# Altium schematic sheet Power.SchDoc
size A4; SheetNumber: 4; SheetTotal: 4
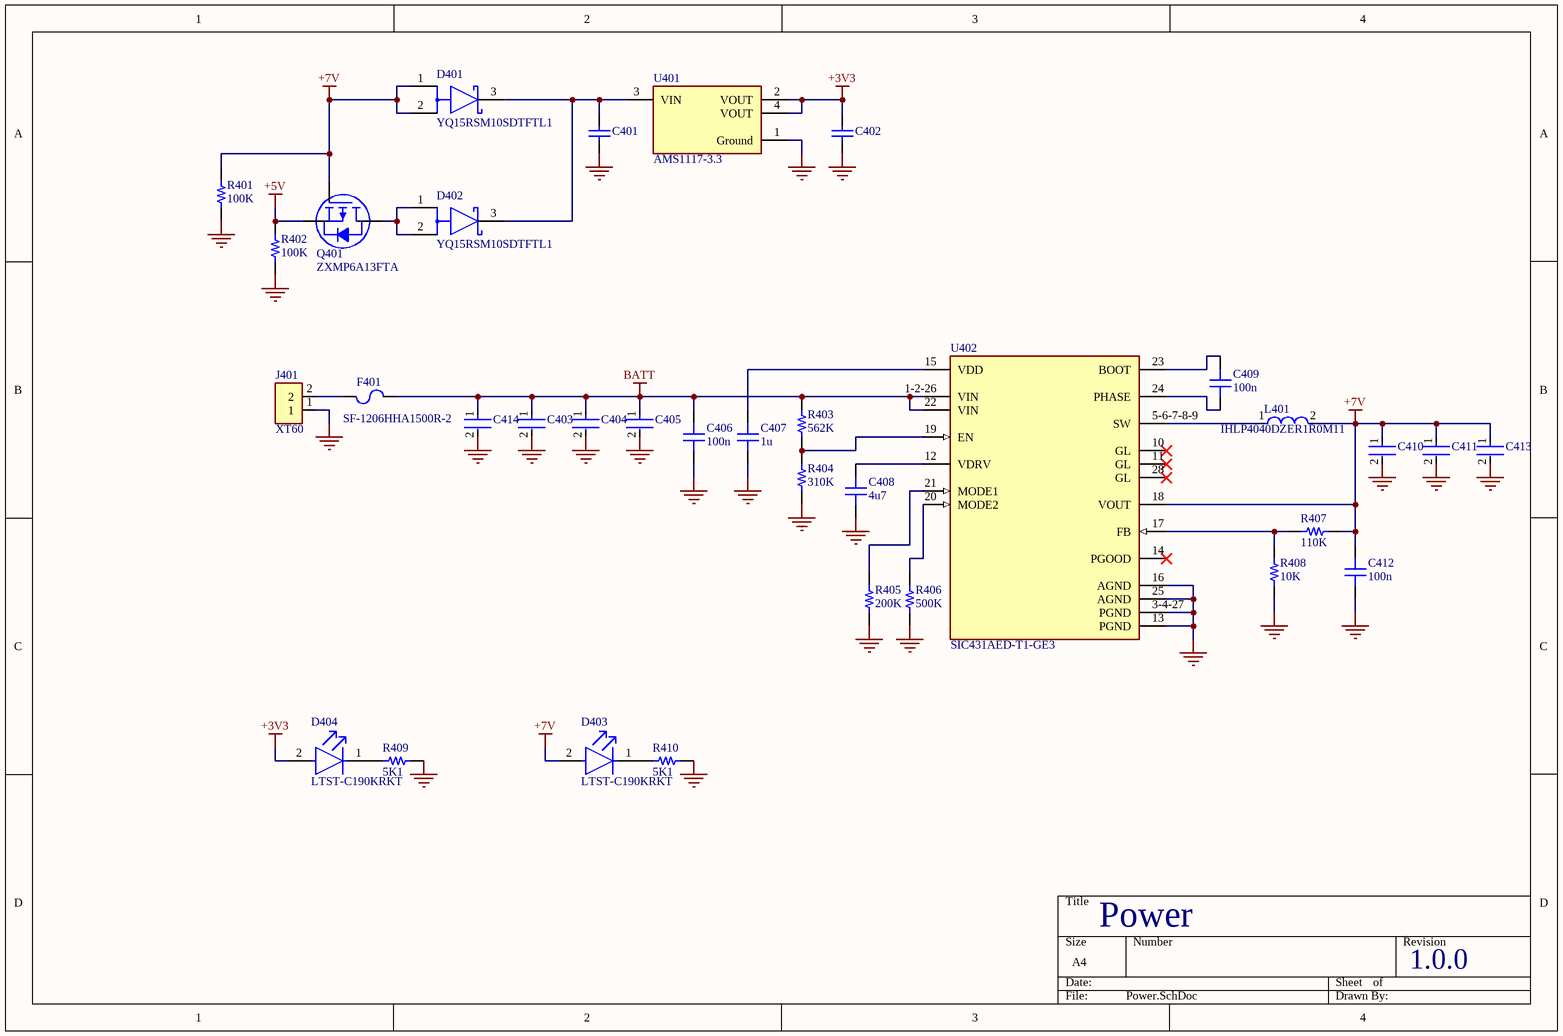
[diagram p0: Power.SchDoc]

## Parts
C401  T529P226M010AAE200  [CAPC2013X100X55ML10T10]  (value not drawn)
C402  T529P226M010AAE200  [CAPC2013X100X55ML10T10]  (value not drawn)
C403  C2012X5R1V226M125AC  [FP-C2012-125-0_2-IPC_C]  (value not drawn)
C404  C2012X5R1V226M125AC  [FP-C2012-125-0_2-IPC_C]  (value not drawn)
C405  C2012X5R1V226M125AC  [FP-C2012-125-0_2-IPC_C]  (value not drawn)
C406  100n  [CAP 0402_1005]
C407  1u  [CAP 0402_1005]
C408  4u7  [CAP 0603_1608]
C409  100n  [CAP 0402_1005]
C410  C2012X5R1V226M125AC  [FP-C2012-125-0_2-IPC_C]  (value not drawn)
C411  C2012X5R1V226M125AC  [FP-C2012-125-0_2-IPC_C]  (value not drawn)
C412  100n  [CAP 0402_1005]
C413  C2012X5R1V226M125AC  [FP-C2012-125-0_2-IPC_C]  (value not drawn)
C414  C2012X5R1V226M125AC  [FP-C2012-125-0_2-IPC_C]  (value not drawn)
D401  YQ15RSM10SDTFTL1  [FP-95570-MFG]
D402  YQ15RSM10SDTFTL1  [FP-95570-MFG]
D403  LTST-C190KRKT  [FP-LTST-C190KRKT-MFG]
D404  LTST-C190KRKT  [FP-LTST-C190KRKT-MFG]
F401  SF-1206HHA1500R-2  [FUSE 1206_3216 0.6MM]
J401  XT60  [AMASS_XT60PB-M]
L401  IHLP4040DZER1R0M11  [FP-IHLP-4040DZ-FP_3_175x4-MFG]
Q401  ZXMP6A13FTA  [DIODES SOT-23-3]
R401  100K  [RES 0402_1005]
R402  100K  [RES 0402_1005]
R403  562K  [RES 0402_1005]
R404  310K  [RES 0402_1005]
R405  200K  [RES 0402_1005]
R406  500K  [RES 0402_1005]
R407  110K  [RES 0402_1005]
R408  10K  [RES 0402_1005]
R409  5K1  [RES 0402_1005]
R410  5K1  [RES 0402_1005]
U401  AMS1117-3.3  [FP-AMS1117-IPC_C]
U402  SIC431AED-T1-GE3  [FP-T22-0442-MFG]

## Nets
+3V3: C402.2 D404.2(A) U401.2(VOUT) U401.4(VOUT)
+5V: Q401.2(S) R402.2
+7V: C410.1 C411.1 C412.2 C413.1 D401.1(A) D401.2(A) D403.2(A) L401.2 Q401.1(G) R401.2 R407.1 U402.18(VOUT)
BATT: C403.1 C404.1 C405.1 C406.2 C414.1 F401.2 R403.1 U402.1-2-26(VIN) U402.22(VIN)
GND: C401.1 C402.1 C403.2 C404.2 C405.2 C406.1 C407.1 C408.1 C410.2 C411.2 C412.1 C413.2 C414.2 J401.1 R401.1 R402.1 R404.2 R405.2 R406.2 R408.2 R409.1 R410.1 U401.1(Ground) U402.3-4-27(PGND) U402.13(PGND) U402.16(AGND) U402.25(AGND)
NetC401_2: C401.2 D401.3(C) D402.3(C) U401.3(VIN)
NetC407_2: C407.2 U402.15(VDD)
NetC408_2: C408.2 U402.12(VDRV)
NetC409_1: C409.1 U402.24(PHASE)
NetC409_2: C409.2 U402.23(BOOT)
NetD402_1: D402.1(A) D402.2(A) Q401.3(D)
NetD403_1: D403.1(C) R410.2
NetD404_1: D404.1(C) R409.2
NetF401_1: F401.1 J401.2
NetL401_1: L401.1 U402.5-6-7-8-9(SW)
NetR403_2: R403.2 R404.1 U402.19(EN)
NetR405_1: R405.1 U402.21(MODE1)
NetR406_1: R406.1 U402.20(MODE2)
NetR407_2: R407.2 R408.1 U402.17(FB)

Not connected (* = marked no-connect by the designer): U402 10(GL)* 11(GL)* 14(PGOOD)* 28(GL)*

## Notes on the sheet
- Power
- 1.0.0

## Library data of the parts
C401 C402 = CMP-2007-03671-1: Manufacturer: Kemet; Part Number: T529P226M010AAE200
C403-C405 C410 C411 C413 C414 = CMP-2000-06038-3: Multilayer Ceramic Capacitors 22μF ±20% 35V X5R SMD 0805; Capacitance: 22uF; Tolerance: 20%; RoHS Compliant: Yes; Height: 1.25mm; Termination: SMD/SMT; Case/Package: 0805; Thickness: 0.057inch; Max Operating Temperature: 85°C; Min Operating Temperature: -55°C; Voltage Rating (DC): 35V; Length: 0.079inch; Dielectric: X5R; Dielectric Material: Ceramic; Voltage Rating: 35V; Mount: Surface Mount; Package Quantity: 2000; Lead Free: Lead Free; Weight: 0.000194oz; REACH SVHC: No SVHC; Width: 0.049inch; Packaging: Tape and Reel; Series: C; Case Code (Metric): 2012; Case Code (Imperial): 0805
C406 C407 C409 C412 = CL05B104KP5VPNC: CAP CER 100NF 10V X7R 0402; manufacturer: Samsung Electro-Mechanics; Capacitance: 0.1 µF; Tolerance: ±10%; Part Number: CL05B104KP5VPNC; Applications: Automotive; componentlink1description: Datasheet; componentlink1url: https://mm.digikey.com/Volume0/opasdata/d220001/medias/docus/5458/CL05B104KP5VPNC_Spec.pdf; componentlink2description: DigiKey Link; componentlink2url: https://www.digikey.com/en/products/detail/samsung-electro-mechanics/CL05B104KP5VPNC/20498482; Device Package: 0402 (1005 Metric); lastupdated: 9/02/2024 8:03:17 PM; Lifecycle Status: Active; Minimum Order: 1; Mounting Type: Surface Mount, MLCC; Operating Temperature: -55°C ~ 125°C; Package / Case: 0402 (1005 Metric); packaging: TapeAndReel; partid: 56690; price: 0.01; Ratings: AEC-Q200; series: CL; Size / Dimension: 0.039" L x 0.020" W (1.00mm x 0.50mm); Supplier 1: DigiKey; Supplier Part Number 1: 1276-CL05B104KP5VPNCCT-ND; Temperature Coefficient: X7R; Thickness (Max): 0.022" (0.55mm); Voltage - Rated: 10V
  C406 C409 C412: Value: 100n
  C407: Value: 1u
C408 = CL10A475KA8NQNC: CAP CER 4.7UF 25V X5R 0603; manufacturer: Samsung Electro-Mechanics; Capacitance: 4.7 µF; Tolerance: ±10%; Part Number: CL10A475KA8NQNC; Value: 4u7; Applications: General Purpose; componentlink1description: Datasheet; componentlink1url: http://www.samsungsem.com/kr/support/product-search/mlcc/CL10A475KA8NQNC.jsp; componentlink2description: DigiKey Link; componentlink2url: https://www.digikey.com/en/products/detail/samsung-electro-mechanics/CL10A475KA8NQNC/3887558; Device Package: 0603 (1608 Metric); lastupdated: 9/02/2024 8:10:30 PM; Lifecycle Status: Active; Minimum Order: 1; Mounting Type: Surface Mount, MLCC; Operating Temperature: -55°C ~ 85°C; Package / Case: 0603 (1608 Metric); packaging: TapeAndReel; partid: 2349; Part Status: Active; price: 0.06; series: CL; Size / Dimension: 0.063" L x 0.031" W (1.60mm x 0.80mm); Supplier 1: DigiKey; Supplier Part Number 1: 1276-1900-1-ND; Temperature Coefficient: X5R; Thickness (Max): 0.035" (0.90mm); Voltage - Rated: 25V
D401 D402 = CMP-02539-000057-1: DIODE SCHOTTKY 100V 5A TO277A; Max Forward Surge Current (Ifsm): 150A; Element Configuration: Common Cathode; Max Reverse Leakage Current: 15uA; Forward Voltage: 880mV; Case/Package: TO-277A; Number of Pins: 3; Max Reverse Voltage (DC): 100V; Height: 0.031inch; Peak Non-Repetitive Surge Current: 150A; Series: eSMP®; Radiation Hardening: No; Length: 0.242inch; Max Repetitive Reverse Voltage (Vrrm): 100V; Forward Current: 5A; Width: 0.171inch; Min Operating Temperature: -55°C; Max Surge Current: 150A; Lead Free: Lead Free; RoHS Compliant: Yes; Average Rectified Current: 5A; Max Operating Temperature: 150°C; Max Reverse Current: 15uA; Package Quantity: 1500; Packaging: Tape and Reel; Mount: Surface Mount
D403 D404 = CMP-1674-00011-2: LED RED CLEAR CHIP SMD; Reverse Voltage: 5V; Viewing Angle: 130°; Power Rating: 75mW; Test Current: 20mA; Number of Elements: 1; Lens Color: Colorless; Wavelength: 639nm; Dominant Wavelength: 631nm; Lens Style: Diffused; Forward Current: 30mA; Forward Voltage: 2.4V; Luminous Intensity: 54mcd; Color: Red; Case Code (Imperial): 0603; Lens Transparency: Clear; Lead Free: Lead Free; Package Quantity: 1; Packaging: Tape and Reel; Max Operating Temperature: 85°C; Number of Pins: 2; Height: 0.8mm; Case/Package: 0603; Number of LEDs: 1; Width: 0.8mm; Case Code (Metric): 1608; Depth: 0.8mm; Mount: Surface Mount; Radiation Hardening: No; Length: 1.6mm; Illumination Color: Red; Power Dissipation: 75mW; Min Operating Temperature: -55°C
F401 = CC12H15A-TR: FUSE BOARD MOUNT 15A 32VDC 1206; Manufacturer: Eaton - Electronics Division; Approval Agency: cURus; Breaking Capacity @ Rated Voltage: 100A; Fuse Type: Board Mount (Cartridge Style Excluded); Melting I²t: 40; Voltage Rating - DC: 32V; Part Number: CC12H15A-TR; Approvals: cURus; ComponentLink1Description: Datasheet; ComponentLink1URL: http://www.cooperindustries.com/content/dam/public/bussmann/Electronics/Resources/product-datasheets/Bus_Elx_DS_4309_CC12H_Series.pdf; ComponentLink2Description: DigiKey Link; ComponentLink2URL: http://digikey.com/product-detail/en/eaton-electronics-division/CC12H15A-TR/283-4493-1-ND/5042389; Current Rating (Amps): 15A; Device Package: 1206 (3216 Metric); LastUpdated: 2/09/2020 1:30:41 AM; Lifecycle Status: Active; Minimum Order: 1; Mounting Type: Surface Mount; Operating Temperature: -55°C ~ 125°C; Package / Case: 1206 (3216 Metric); Packaging: TapeAndReel; Part Status: Active; Price: 0.39; Series: CC12H; Size / Dimension: 0.063" L x 0.126" W x 0.024" H (1.60mm x 3.20mm x 0.60mm); Supplier 1: DigiKey; Supplier Part Number 1: 283-4493-1-ND
J401 = XT60_YELLOW: Power connector; 65A; PIN: 2; Colour: yellow; MP: XT60 YELLOW; MF: Pololu; SnapEDA_Link: https://www.snapeda.com/parts/XT60%20YELLOW/Pololu/view-part/?ref=snap; Availability: Not in stock; Package: None; Check_prices: https://www.snapeda.com/parts/XT60%20YELLOW/Pololu/view-part/?ref=eda; Value: *; Price: None
L401 = CMP-02424-000442-1: Commercial Inductors, Low DCR Series 1uH 25A 2.5mΩ 20%; Saturation Current: 20A; Self Resonant Frequency: 1MHz; Shielding: Shielded; Core Material: Metal; DC Resistance (DCR): 2.5mR; Test Frequency: 100kHz; Min Operating Temperature: -55°C; Package Quantity: 1; Depth: 10.3mm; Case Code (Imperial): 4040; Height - Seated (Max): 0.157inch; Width: 0.405inch; RMS Current (Irms): 25A; Height: 4mm; Length: 0.43inch; Packaging: Tape and Reel; Inductance: 1uH; Number of Pins: 2; Military Standard: Not; Current Rating: 25A; Lead Free: Lead Free; Mount: Surface Mount; Case/Package: 4040; Tolerance: 20%; Termination: SMD/SMT; Radiation Hardening: No; Inductance Tolerance: 20%; Max DC Current: 20A; Max Operating Temperature: 125°C
Q401 = ZXMP6A13FTA: MOSFET P-CH 60V 900MA SOT23-3; Manufacturer: Diodes Incorporated; Current - Continuous Drain (Id) @ 25°C: 900mA (Ta); Drive Voltage (Max Rds On,  Min Rds On): 4.5V, 10V; FET Type: P-Channel; Gate Charge (Qg) (Max) @ Vgs: 5.9 nC @ 10 V; Input Capacitance (Ciss) (Max) @ Vds: 219 pF @ 30 V; Power Dissipation (Max): 625mW (Ta); Rds On (Max) @ Id, Vgs: 400mOhm @ 900mA, 10V; Vgs (Max): ±20V; Vgs(th) (Max) @ Id: 3V @ 250µA; Part Number: ZXMP6A13FTA; ComponentLink1Description: Datasheet; ComponentLink1URL: https://www.diodes.com/assets/Datasheets/ZXMP6A13F.pdf; ComponentLink2Description: DigiKey Link; ComponentLink2URL: https://www.digikey.com/en/products/detail/diodes-incorporated/ZXMP6A13FTA/560639; Drain to Source Voltage (Vdss): 60 V; LastUpdated: 11/03/2024 8:04:08 AM; Lifecycle Status: Active; Minimum Order: 1; Mounting Type: Surface Mount; Operating Temperature: -55°C ~ 150°C (TJ); Package / Case: TO-236-3, SC-59, SOT-23-3; Packaging: TapeAndReel; Part Status: Active; Price: 0.16; Series: -; Supplier 1: DigiKey; Supplier Part Number 1: ZXMP6A13FCT-ND; Supplier Device Package: SOT-23-3; Technology: MOSFET (Metal Oxide)
R401-R410 = AC0402JR-075K1L: RES SMD 5.1K OHM 5% 1/16W 0402; Manufacturer: Yageo; Power (Watts): 0.063W, 1/16W; Resistance: 5.1 kOhms; Temperature Coefficient: ±100ppm/°C; Part Number: AC0402JR-075K1L; ComponentLink1Description: Datasheet; ComponentLink1URL: https://www.yageo.com/upload/media/product/productsearch/datasheet/rchip/PYu-AC_51_RoHS_L_7.pdf; ComponentLink2Description: DigiKey Link; ComponentLink2URL: https://www.digikey.com/en/products/detail/yageo/AC0402JR-075K1L/5895695; Composition: Thick Film; Device Package: 0402 (1005 Metric); Features: Automotive AEC-Q200, Moisture Resistant; Height - Seated (Max): 0.015" (0.37mm); LastUpdated: 9/02/2024 8:30:14 PM; Lifecycle Status: Active; Minimum Order: 1; Number of Terminations: 2; Operating Temperature: -55°C ~ 155°C; Package / Case: 0402 (1005 Metric); Packaging: CutTape; PartId: 4690; Part Status: Active; Price: 0.01; Ratings: AEC-Q200; Series: AC; Size / Dimension: 0.039" L x 0.020" W (1.00mm x 0.50mm); Supplier 1: DigiKey; Supplier Part Number 1: YAG3554CT-ND; Supplier Device Package: 0402; Tolerance: ±5%
  R401 R402: Value: 100K
  R403: Value: 562K
  R404: Value: 310K
  R405: Value: 200K
  R406: Value: 500K
  R407: Value: 110K
  R408: Value: 10K
  R409 R410: Value: 5K1
U401 = CMP-209535-000001-1: LDO Voltage Regulators 1A, 3.3V; Manufacturer: Advanced Monolithic Systems; Dropout Voltage: 1.1V; Output Type: Fixed; Nominal Supply Current: 5mA; Max Power Dissipation: 1.2W; Max Supply Voltage: 15V; Number Of Outputs: 1; Standoff Height: 0.64mm; Max Junction Temp: +125°C; Height: 1.8mm; Package: AMS1117; Device Class L2: Power Management ICs; ComponentLink2Description: Datasheet; ComponentLink2URL: http://www.advanced-monolithic.com/pdf/ds1117.pdf; Category: IC; RoHS: TRUE; Automotive: No; Device Class L1: Integrated Circuits (ICs); Output Current: 1A; Device Class L3: Voltage Regulators - Linear; Temperature: -40°C to +125°C; Output Voltage: 3.3V; Manufacturer Part Number: AMS1117-3.3; Temperature Range Low: -40°C; Octopart: https://octopart.com/ams1117-3.3-advanced+monolithic+systems-25899300; Lead Free: Yes; Ipc Land Pattern Name: SOT229P700X180-4; Temperature Range High: +125°C
U402 = CMP-00030-87948104-1: SIC431AED-T1-GE3 IC Reg Buck Adj 24A MLP44-24; Max Supply Voltage: 24V; Number of Outputs: 1; Max Junction Temperature (Tj): 125°C; Min Supply Voltage: 3V; Output Voltage: 20V; NexarPartId: 87948104; Min Operating Temperature: -40°C; Schedule B: 8542390000, 8542390000; RoHS: Non-Compliant; Max Operating Temperature: 125°C; Height: 800µm; Ambient Temperature Range High: 105°C; Output Current: 24A